# Altium project MINI-STM32.PRJPCB
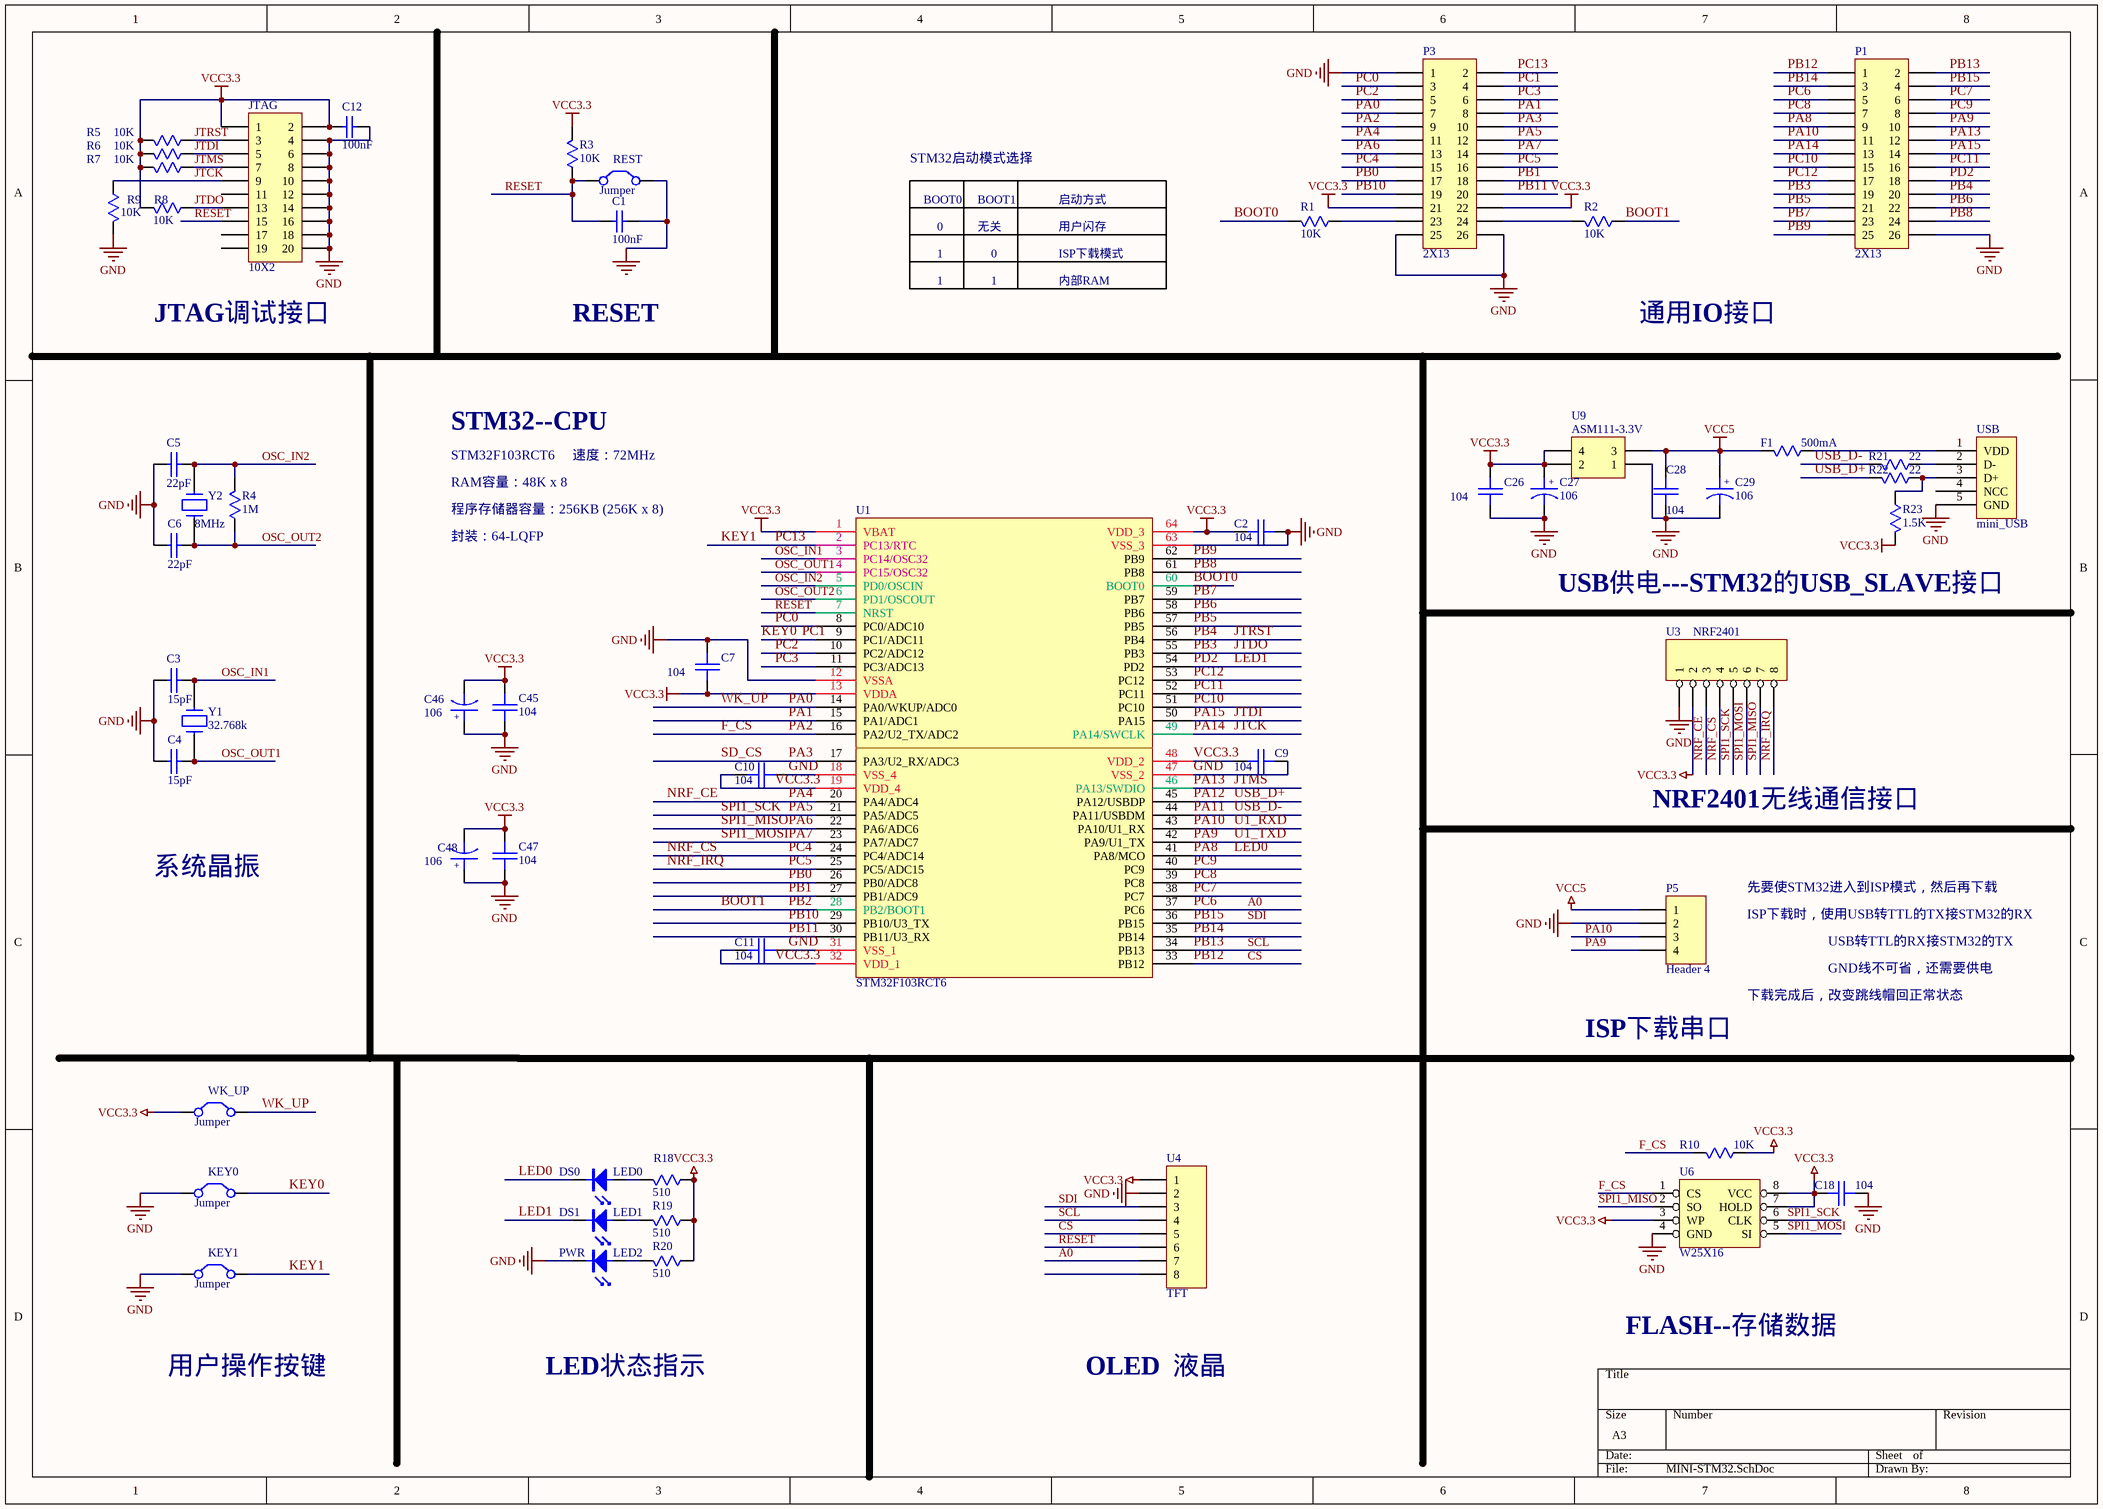
[diagram p0: MINI-STM32.SchDoc]
1 sheet, 56 parts. Net scope: global (net labels, ports and power ports of the same name join across sheets).
Board file: MINI-STM32.PcbDoc

## Sheet MINI-STM32.SchDoc
size A3

### Parts
C1  100nF  [0603C]
C2  104  [0603J]
C3  15pF  [0603J]
C4  15pF  [0603J]
C5  22pF  [0603J]
C6  22pF  [0603J]
C7  104  [0603J]
C9  104  [0603J]
C10  104  [0603J]
C11  104  [0603J]
C12  100nF  [0603C]
C18  104  [0603J]
C26  104  [0603J]
C27  106  [10UF_T]
C28  104  [0603J]
C29  106  [10UF_T]
C45  104  [0603J]
C46  106  [TAN-B]
C47  104  [0603J]
C48  106  [TAN-B]
F1  500mA  [C1210]
JTAG  10X2  [IDC20]
KEY0  Jumper  [key4]
KEY1  Jumper  [key4]
LED0  DS0  [LED0805]
LED1  DS1  [LED0805]
LED2  PWR  [LED0805]
P1  2X13  [HDR2X13]
P3  2X13  [HDR2X13]
P5  Header 4  [HDR1X4]
R1  10K  [0603J]
R2  10K  [0603J]
R3  10K  [0603J]
R4  1M  [R0603]
R5  10K  [0603J]
R6  10K  [0603J]
R7  10K  [0603J]
R8  10K  [0603J]
R9  10K  [0603J]
R10  10K  [0603J]
R18  510  [0603J]
R19  510  [0603J]
R20  510  [0603J]
R21  22  [0603J]
R22  22  [0603J]
R23  1.5K  [0603J]
REST  Jumper  [key4]
U1  STM32F103RCT6  [QFP64/P0.5/W12]
U3  NRF2401  [HDR2X4]
U4  TFT  [HDR1X8]
U6  W25X16  [SOIC8P]
U9  ASM111-3.3V  [SOT223]
USB  mini_USB  [MINIUSB]
WK_UP  Jumper  [key4]
Y1  32.768k  [32.768k]
Y2  8MHz  [smt-xtal]

### Nets
GND: C1.1 C2.2 C3.1 C4.1 C5.1 C6.1 C7.1 C9.2 C10.2 C11.2 C12.1 C18.1 C26.2 C27.2 C28.2 C29.2 C45.2 C46.1 C47.2 C48.1 JTAG.4 JTAG.6 JTAG.8 JTAG.10 JTAG.12 JTAG.14 JTAG.16 JTAG.18 JTAG.20 KEY0.1(C1) KEY1.1(C1) LED2.K P1.26 P3.1 P3.25 P3.26 P5.2 R9.2 REST.2(C2) U1.12(VSSA) U1.18(VSS_4) U1.31(VSS_1) U1.47(VSS_2) U1.63(VSS_3) U3.1 U4.2 U6.4(GND) U9.1 USB.5(GND)
VCC3.3: C2.1 C7.2 C9.1 C10.1 C11.1 C12.2 C18.2 C26.1 C27.1 C45.1 C46.2 C47.1 C48.2 JTAG.1 JTAG.2 P3.21 P3.22 R3.2 R5.2 R6.2 R7.2 R8.2 R10.1 R18.1 R19.1 R20.1 R23.2 U1.1(VBAT) U1.13(VDDA) U1.19(VDD_4) U1.32(VDD_1) U1.48(VDD_2) U1.64(VDD_3) U3.2 U4.1 U6.3(WP) U6.7(HOLD) U6.8(VCC) U9.2 U9.4 WK_UP.1(C1)
VCC5: C28.1 C29.1 F1.2 P5.1 U9.3
A0: P1.5 U1.37(PC6) U4.7  [also labelled PC6]
BOOT0: R1.2 U1.60(BOOT0)
BOOT1: R2.1 U1.28(PB2/BOOT1)  [also labelled PB2]
CS: P1.1 U1.33(PB12) U4.5  [also labelled PB12]
F_CS: P3.9 R10.2 U1.16(PA2/U2_TX/ADC2) U6.1(CS)  [also labelled PA2]
JTCK: JTAG.9 P1.13 R9.1 U1.49(PA14/SWCLK)  [also labelled PA14]
JTDI: JTAG.5 P1.14 R6.1 U1.50(PA15)  [also labelled PA15]
JTDO: JTAG.13 P1.19 R8.1 U1.55(PB3)  [also labelled PB3]
JTMS: JTAG.7 P1.12 R7.1 U1.46(PA13/SWDIO)  [also labelled PA13]
JTRST: JTAG.3 P1.20 R5.1 U1.56(PB4)  [also labelled PB4]
KEY0: KEY0.2(C2) P3.4 U1.9(PC1/ADC11)  [also labelled PC1]
KEY1: KEY1.2(C2) P3.2 U1.2(PC13/RTC)  [also labelled PC13]
LED0: LED0.K P1.9 U1.41(PA8/MCO)  [also labelled PA8]
LED1: LED1.K P1.18 U1.54(PD2)  [also labelled PD2]
NRF_CE: P3.11 U1.20(PA4/ADC4) U3.3  [also labelled PA4]
NRF_CS: P3.15 U1.24(PC4/ADC14) U3.4  [also labelled PC4]
NRF_IRQ: P3.16 U1.25(PC5/ADC15) U3.8  [also labelled PC5]
OSC_IN1: C3.2 U1.3(PC14/OSC32) Y1.2
OSC_IN2: C5.2 R4.2 U1.5(PD0/OSCIN) Y2.1
OSC_OUT1: C4.2 U1.4(PC15/OSC32) Y1.1
OSC_OUT2: C6.2 R4.1 U1.6(PD1/OSCOUT) Y2.2
PA0: P3.7 U1.14(PA0/WKUP/ADC0) WK_UP.2(C2)  [also labelled WK_UP]
PA1: P3.8 U1.15(PA1/ADC1)
PA3: P3.10 U1.17(PA3/U2_RX/ADC3)  [also labelled SD_CS]
PA5: P3.12 U1.21(PA5/ADC5) U3.5 U6.6(CLK)  [also labelled SPI1_SCK]
PA6: P3.13 U1.22(PA6/ADC6) U3.7 U6.2(SO)  [also labelled SPI1_MISO]
PA7: P3.14 U1.23(PA7/ADC7) U3.6 U6.5(SI)  [also labelled SPI1_MOSI]
PA9: P1.10 P5.4 U1.42(PA9/U1_TX)  [also labelled U1_TXD]
PA10: P1.11 P5.3 U1.43(PA10/U1_RX)  [also labelled U1_RXD]
PA11: R21.2 U1.44(PA11/USBDM)  [also labelled USB_D-]
PA12: R22.2 U1.45(PA12/USBDP)  [also labelled USB_D+]
PB0: P3.17 U1.26(PB0/ADC8)
PB1: P3.18 U1.27(PB1/ADC9)
PB5: P1.21 U1.57(PB5)
PB6: P1.22 U1.58(PB6)
PB7: P1.23 U1.59(PB7)
PB8: P1.24 U1.61(PB8)
PB9: P1.25 U1.62(PB9)
PB10: P3.19 U1.29(PB10/U3_TX)
PB11: P3.20 U1.30(PB11/U3_RX)
PB13: P1.2 U1.34(PB13) U4.4  [also labelled SCL]
PB14: P1.3 U1.35(PB14)
PB15: P1.4 U1.36(PB15) U4.3  [also labelled SDI]
PC0: P3.3 U1.8(PC0/ADC10)
PC2: P3.5 U1.10(PC2/ADC12)
PC3: P3.6 U1.11(PC3/ADC13)
PC7: P1.6 U1.38(PC7)
PC8: P1.7 U1.39(PC8)
PC9: P1.8 U1.40(PC9)
PC10: P1.15 U1.51(PC10)
PC11: P1.16 U1.52(PC11)
PC12: P1.17 U1.53(PC12)
RESET: C1.2 JTAG.15 R3.1 REST.1(C1) U1.7(NRST) U4.6
NetF1_1: F1.1 USB.1(VDD)
NetLED0_A: LED0.A R18.2
NetLED1_A: LED1.A R19.2
NetLED2_A: LED2.A R20.2
NetP3_23: P3.23 R1.1
NetP3_24: P3.24 R2.2
NetR21_1: R21.1 USB.2(D-)
NetR22_1: R22.1 R23.1 USB.3(D+)

Not connected (* = marked no-connect by the designer): JTAG 11 17 19; U4 8; USB 4(NCC)

### Notes on the sheet
- STM32启动模式选择
- BOOT0
- 0
- BOOT1
- 无关
- 启动方式
- 用户闪存
- 1
- ISP下载模式
- 内部RAM
- (near JTAG) JTAG调试接口
- RESET
- 通用IO接口
- STM32--CPU
- STM32F103RCT6
- 程序存储器容量：256KB (256K x 8)
- RAM容量：48K x 8
- 速度：72MHz
- 封装：64-LQFP
- (near R23) USB供电---STM32的USB_SLAVE接口
- NRF2401无线通信接口
- 系统晶振
- ISP下载时，使用USB转TTL的TX接STM32的RX
- 先要使STM32进入到ISP模式，然后再下载
- USB转TTL的RX接STM32的TX
- GND线不可省，还需要供电
- ISP下载串口
- 下载完成后，改变跳线帽回正常状态
- 用户操作按键
- LED状态指示
- OLED  液晶
- FLASH--存储数据
- (in symbol CAP2) +

### Library data of the parts
C1 C12 = CAP: GRM39 X7R102K50PT; Value: 100pF; Published: 8-Jun-2000; Revision: July-2002: Re-released for DXP Platform.; Publisher: Altium Limited; REF: GRM39 X7R102K50PT
C2 C7 C9-C11 C18 C26 C28 C45 C47 = CAP
C3-C6 = CAP: CAP CHIP 20P 50V(+-5% C0G 0603); Value: 20pF
C27 C29 C46 C48 = CAP2
F1 R1-R10 R18-R23 = RES
JTAG = Header 10X2H: Header, 10-Pin, Dual row, Right Angle; LatestRevisionDate: 17-Jul-2002; LatestRevisionNote: Re-released for DXP Platform.; Publisher: Altium Limited
KEY0 KEY1 REST WK_UP = Jumper: Jumper Wire; Published: 24-Mar-1999; LatestRevisionDate: 17-Jul-2002; LatestRevisionNote: Re-released for DXP Platform.; PackageReference: RAD-0.2; Publisher: Altium Limited
LED0-LED2 = LED
P1 P3 = MHDR2X13: Header, 13-Pin, Dual row; LatestRevisionDate: 17-Jul-2002; LatestRevisionNote: Re-released for DXP Platform.; Publisher: Altium Limited
P5 = Header 4: Header, 4-Pin; LatestRevisionDate: 17-Jul-2002; LatestRevisionNote: Re-released for DXP Platform.; Publisher: Altium Limited
U1 = STM32F103RBT6
U3 = HEADER 8: 8 Pin Header
U4 = Header 8: Header, 8-Pin
U9 = Header 2X2H: Header, 2-Pin, Dual row, Right Angle; LatestRevisionDate: 17-Jul-2002; LatestRevisionNote: Re-released for DXP Platform.; Publisher: Altium Limited
USB = usb
Y1 Y2 = CRYSTAL: Crystal 8MHz PLUG; Value: 8MHz